# Altium schematic sheet MAX3488AEGSA+.SchDoc
size Letter
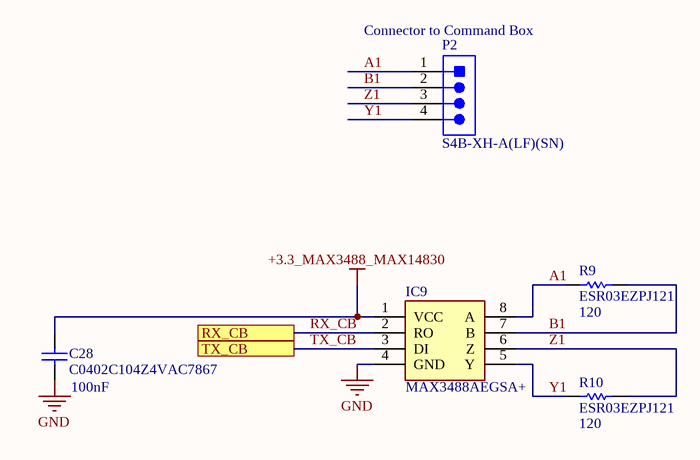
[diagram p0: MAX3488AEGSA+.SchDoc]

## Parts
C28  C0402C104Z4VAC7867  Spec: 100nF  [CAPC1005X60X30LL05T10]
IC9  MAX3488AEGSA+  [SOIC127P600X175-8N]
P2  S4B-XH-A(LF)(SN)  [JST-S4B-XH-A(LF)(SN)_V]
R9  ESR03EZPJ121  value 120  [1608[0603]]
R10  ESR03EZPJ121  value 120  [1608[0603]]

## Ports
RX_CB, TX_CB

## Nets
+3.3_MAX3488_MAX14830: C28.2 IC9.1(VCC)
GND: C28.1 IC9.4(GND)
A1: IC9.8(A) P2.1 R9.1
B1: IC9.7(B) P2.2 R9.2
RX_CB: IC9.2(RO) ; port RX_CB
TX_CB: IC9.3(DI) ; port TX_CB
Y1: IC9.5(Y) P2.4 R10.1
Z1: IC9.6(Z) P2.3 R10.2

## Notes on the sheet
- (near P2) Connector to Command Box
- Title
- Size:
- Date:
- Letter
- Number:
- Time:
- Revision:
- Sheet
- of
- Rocket Propulsion Laboratory
- UC San Diego
- Avionics Team
- Author :
- File:

## Library data of the parts
C28 = CMP-2008-02369-1: Manufacturer: Kemet; Part Number: C0402C104Z4VAC7867
IC9 = MAX3488AEGSA+: Integrated Circuit; Manufacturer_Name: Maxim Integrated; Datasheet Link: https://datasheets.maximintegrated.com/en/ds/MAX3483AE-MAX3491AE.pdf; Height: 1.75mm; Manufacturer_Part_Number: MAX3488AEGSA+; Arrow Part Number: MAX3488AEGSA+; Mouser Part Number: 700-MAX3488AEGSA+; Mouser Price/Stock: https://www.mouser.com/Search/Refine.aspx?Keyword=700-MAX3488AEGSA%2B
P2 = CMP-1755-00007-1: Male Header, Pitch 2.5 mm, 1 x 4 Position, Height 6.1 mm, Tail Length 3.4 mm, -25 to 85 degC, RoHS, Bulk; PackageReference: S4B-XH-A(LF)(SN); ComponentLink1Description: Manufacturer URL; DatasheetVersion: May-16; ComponentLink2Description: Datasheet; ComponentLink2URL: http://www.jst-mfg.com/product/pdf/eng/eXH.pdf; ComponentLink1URL: http://www.jst.com/home2.html; PackageDescription: Male Header, Pitch 2.5 mm, 1 x 4 Position, Height 6.1 mm, Tail Length 3.4 mm
R9 R10 = Res1: Resistor; Published: 8-Jun-2000; LatestRevisionDate: 17-Jul-2002; LatestRevisionNote: Re-released for DXP Platform.; PackageReference: AXIAL-0.3; Publisher: Altium Limited; PackageDescription: Axial Device, Thru-Hole; 2 Leads; 0.3 in Pin Spacing